# Altium schematic sheet TempSensor.SchDoc
size 420 x 297 mm
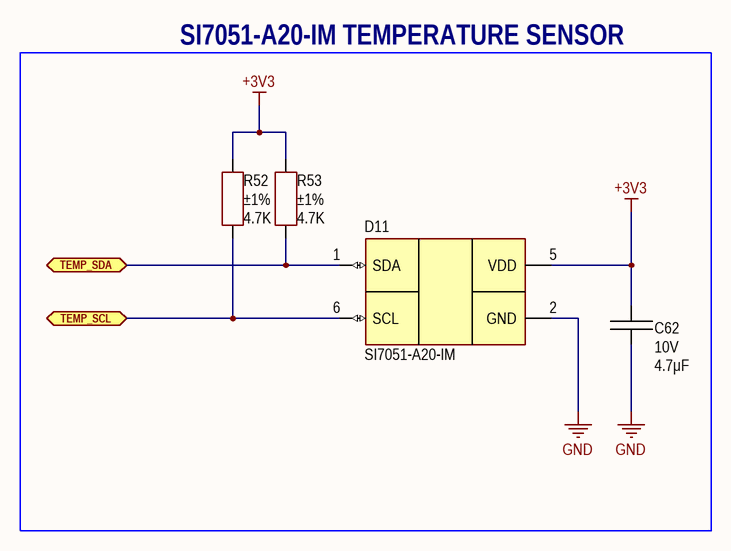
[diagram p0: TempSensor.SchDoc]

## Parts
C62  value 4.7μF  Voltage: 10V  [CAP: 0805]
D11  (no value)  [6-WDFN(3x3)]
R52  value 4.7K  Tolerance: ±1%  [RES: 0805]
R53  value 4.7K  Tolerance: ±1%  [RES: 0805]

## Blocks framed on the sheet
SI7051-A20-IM TEMPERATURE SENSOR: C62 D11 R52 R53

## Ports
TEMP_SCL (bidir), TEMP_SDA (bidir)

## Nets
+3V3: C62.2 D11.5(VDD) R52.1 R53.1
GND: C62.1 D11.2(GND)
TEMP_SCL: D11.6(SCL) R52.2 ; port TEMP_SCL
TEMP_SDA: D11.1(SDA) R53.2 ; port TEMP_SDA

## Notes on the sheet
- Author
- Manufacturer
- Date
- Page
- Total pages
- Size page
- A3
- Materials

## Library data of the parts
C62 = Ceramic_0805: 4.7 µF ±10% 16V Ceramic Capacitor X7R 0805 (2012 Metric); Manufacturer: Yageo; PartNumber: CC0805KKX7R7BB475; ValueManufacturerPartNumber: Ceramic capacitor, 4.7μF, X7R, ±10%, 10V, 0805, -55...+125°C; Package: 0805; HelpURL: https://www.digikey.com/en/products/detail/yageo/CC0805KKX7R7BB475/5195289; Temperature: -55...+125°C; TypeCapacitor: Ceramic capacitor; Tolerance: ±10%; TypeDielectric: X7R
D11 = SI7051-A20-IM: Temperature sensor; Manufacturer: Silicon Labs; Supply: 1.9...3.6V; Accuracy: ±0.1°C; Sensing: Digital sensor; HelpURL: https://www.digikey.com/en/products/detail/silicon-labs/SI7051-A20-IM/5882974; Package: 6-WDFN; ComponentType: IC temperature sensor; ValueManufacturerPartNumber: =ComponentType+', '+Sensing+', '+Accuracy+', '+GainBandwidth+', '+Sensitivity+', '+Temperature+', '+Package; Temperature: -40...+125°C; PartNumber: SI7051-A20-IM
R52 R53 = Resistor_0805: 4.7 kOhms ±5% 0.125W, 1/8W Chip Resistor 0805 (2012 Metric) Moisture Resistant Thick Film; Manufacturer: Yageo; PartNumber: RC0805JR-074K7L; ValueManufacturerPartNumber: Resistor film, 4.7K, ±1%, 0805, 0.125W, -55...+125°C; TypeResistor: Resistor film; Package: 0805; HelpURL: https://www.digikey.com/en/products/detail/yageo/RC0805JR-074K7L/728327; Temperature: -55...+125°C; Power: 0.125W